# EAGLE design mcuBoard (EAGLE 7.4.0)
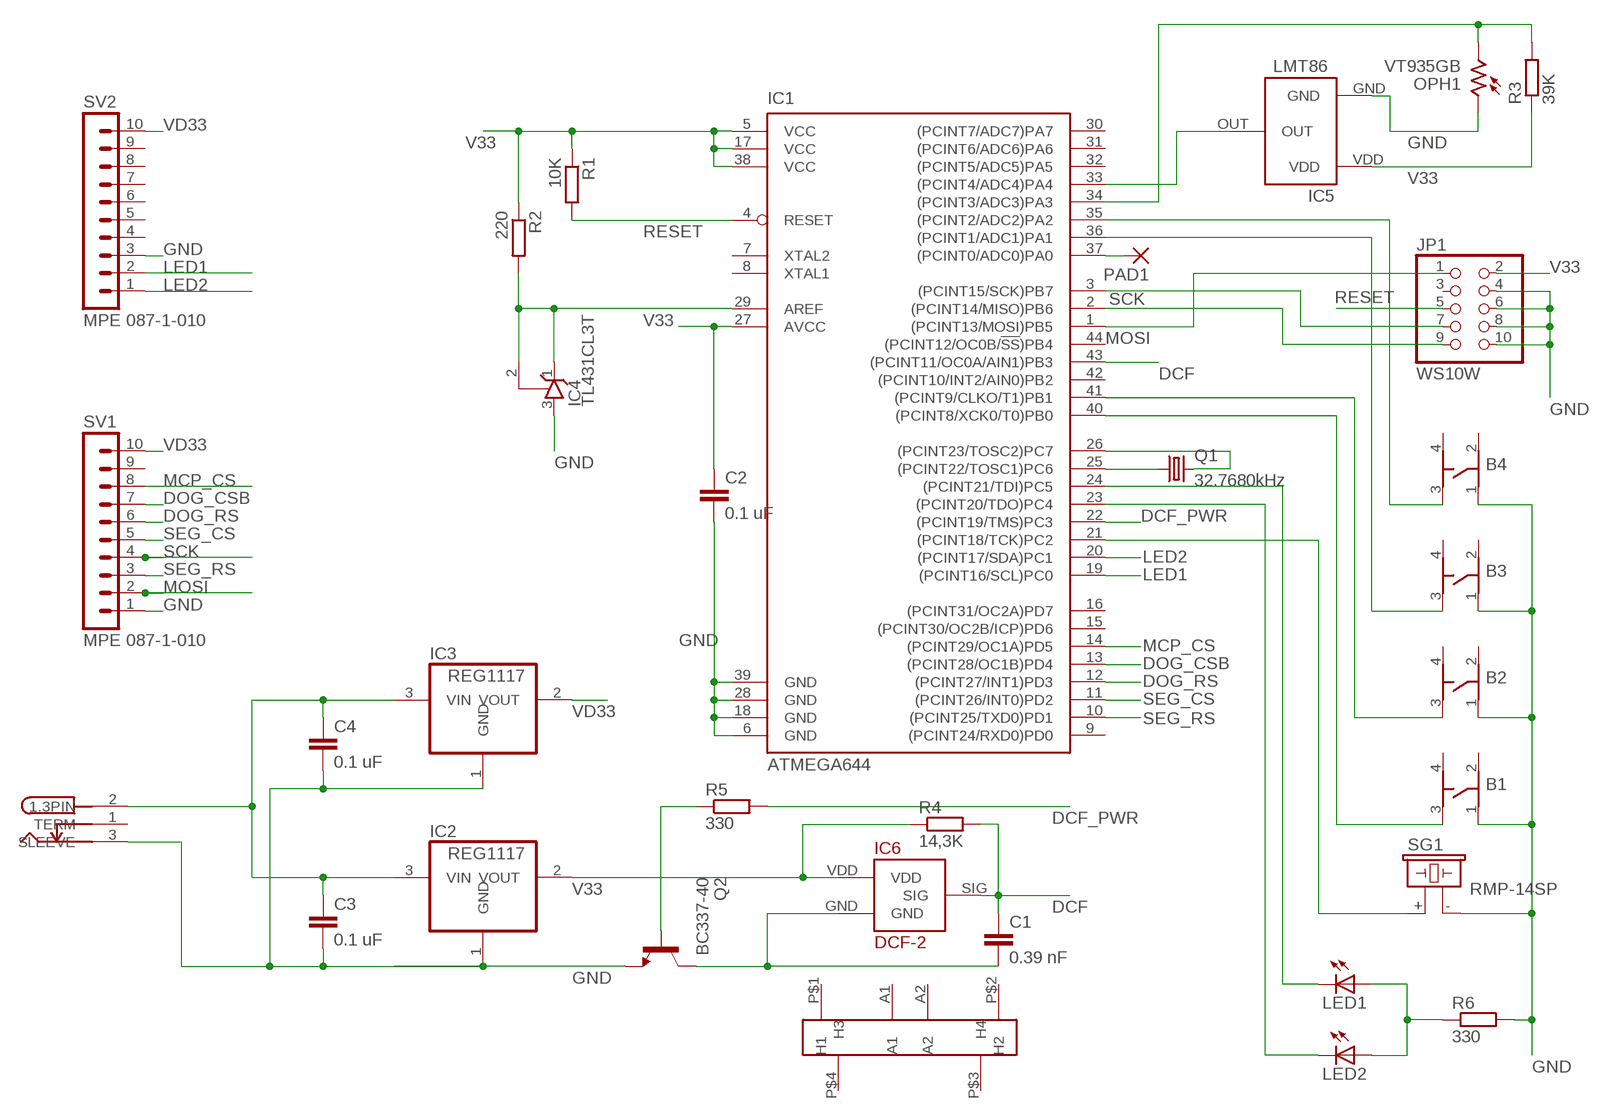
[diagram p0: schematic, sheet 1]

## Parts
B1  BUTTON-D6X  [BUTTON-D6X]
B2  BUTTON-D6X  [BUTTON-D6X]
B3  BUTTON-D6X  [BUTTON-D6X]
B4  BUTTON-D6X  [BUTTON-D6X]
C1  0.39 nF  C-EUC1206  [C1206]
C2  0.1 uF  C-EUC1206K  [C1206K]
C3  0.1 uF  C-EUC1206K  [C1206K]
C4  0.1 uF  C-EUC1206K  [C1206K]
IC1  ATMEGA644  ATMEGA644A  [TQFP44]
IC2  REG1117  [SOT223]
IC3  REG1117  [SOT223]
IC4  TL431CL3T  [SOT23]
IC5  LMT86  [LMT86]
IC6  DCF77  [DCF77]
JP1  WS10W  PINHD-2X5  [2X05]
LED1  LED3MM  [LED3MM]
LED2  LED3MM  [LED3MM]
OPH1  VT935GB  [VT900]
PAD1  1,6/0,8  [1,6/0,8]
Q1  32.7680kHz  MC-306  [MC-306]
Q2  BC337-40  [TO92]
R1  10K  R-EU_M1206  [M1206]
R2  220  R-EU_M1206  [M1206]
R3  39K  R-EU_M1206  [M1206]
R4  14,3K  R-EU_R1206  [R1206]
R5  330  R-EU_R1206  [R1206]
R6  330  R-EU_M1206  [M1206]
SG1  RMP-14SP  F/CM12P  [F/CM12P]
SV1  MPE 087-1-010  MA10-1  [MA10-1]
SV2  MPE 087-1-010  MA10-1  [MA10-1]
U$1  DC-8N  [BUCHSE-1.3X3.75]
U$2  DCF77-ANT  [DCF77-ANT]

## Nets
DCF: C1.1 IC1.43((PCINT11/OC0A/AIN1)PB3) IC6.SIG R4.2
DCF_PWR: IC1.22((PCINT19/TMS)PC3) R5.2
DOG_CSB: IC1.13((PCINT28/OC1B)PD4) SV1.7
DOG_RS: IC1.12((PCINT27/INT1)PD3) SV1.6
GND: B1.1 B2.1 B3.1 B4.1 C2.2 C3.2 C4.2 IC1.6(GND) IC1.18(GND) IC1.28(GND) IC1.39(GND) IC2.1(GND) IC3.1(GND) IC4.3(A) IC5.GND JP1.4 JP1.6 JP1.8 JP1.10 OPH1.1 Q2.1(E) R6.2 SG1.- SV1.1 SV2.3 U$1.3(SLEEVE)
LED1: IC1.19((PCINT16/SCL)PC0) SV2.2
LED2: IC1.20((PCINT17/SDA)PC1) SV2.1
MCP_CS: IC1.14((PCINT29/OC1A)PD5) SV1.8
MOSI: IC1.1((PCINT13/MOSI)PB5) JP1.1 SV1.2
N$1: C3.1 C4.1 IC2.3(VIN) IC3.3(VIN) U$1.2(1.3PIN)
N$18: IC1.2((PCINT14/MISO)PB6) JP1.9
N$28: B3.3 IC1.36((PCINT1/ADC1)PA1)
N$29: B2.3 IC1.41((PCINT9/CLKO/T1)PB1)
N$30: B1.3 IC1.40((PCINT8/XCK0/T0)PB0)
N$38: IC1.25((PCINT22/TOSC1)PC6) Q1.1
N$39: IC1.29(AREF) IC4.1(C) IC4.2(R) R2.2
N$40: IC1.26((PCINT23/TOSC2)PC7) Q1.4
N$41: IC1.21((PCINT18/TCK)PC2) SG1.+
N$42: IC1.33((PCINT4/ADC4)PA4) IC5.OUT
N$45: B4.3 IC1.35((PCINT2/ADC2)PA2)
N$47: IC1.34((PCINT3/ADC3)PA3) OPH1.2 R3.2
N$50: IC1.37((PCINT0/ADC0)PA0) PAD1.1(P)
N$54: C1.2 IC6.GND Q2.3(C)
N$55: Q2.2(B) R5.1
N$56: LED1.A LED2.A R6.1
N$58: IC1.24((PCINT21/TDI)PC5) LED1.K(C)
N$60: IC1.23((PCINT20/TDO)PC4) LED2.K(C)
RESET: IC1.4(RESET) JP1.5 R1.2
SCK: IC1.3((PCINT15/SCK)PB7) JP1.7 SV1.4
SEG_CS: IC1.11((PCINT26/INT0)PD2) SV1.5
SEG_RS: IC1.10((PCINT25/TXD0)PD1) SV1.3
V33: C2.1 IC1.5(VCC) IC1.17(VCC) IC1.27(AVCC) IC1.38(VCC) IC2.2(VOUT) IC5.VDD IC6.VDD JP1.2 R1.1 R2.1 R3.1 R4.1
VD33: IC3.2(VOUT) SV1.10 SV2.10
Unconnected: B1.2 B1.4 B2.2 B2.4 B3.2 B3.4 B4.2 B4.4 IC1.7(XTAL2) IC1.8(XTAL1) IC1.9((PCINT24/RXD0)PD0) IC1.15((PCINT30/OC2B/ICP)PD6) IC1.16((PCINT31/OC2A)PD7) IC1.30((PCINT7/ADC7)PA7) IC1.31((PCINT6/ADC6)PA6) IC1.32((PCINT5/ADC5)PA5) IC1.42((PCINT10/INT2/AIN0)PB2) IC1.44((PCINT12/OC0B/!SS!)PB4) JP1.3 SV1.9 SV2.4 SV2.5 SV2.6 SV2.7 SV2.8 SV2.9 U$1.1(TERM) U$2.A1 U$2.A2 U$2.P$1(H1) U$2.P$2(H2) U$2.P$3(H4) U$2.P$4(H3)

## Library data of the parts
B1-B4 = MyComponents:BUTTON-D6X
C1-C4 = rcl:C-EU: CAPACITOR, European symbol
IC1 = atmel:ATMEGA644: 8-bit Microcontroller with 64K Bytes In-System Programmable Flash Source: http://www.atmel.com/dyn/resources/prod_documents/doc2593.pdf; MPN: ATMEGA644PV-10AU; OC_FARNELL: 1455123; OC_NEWARK: 58M3748
IC2 IC3 = burr-brown:REG1117: 800mA and 1A Low Dropout (LDO) Positive Regulator 1.8V, 2.5V, 2.85V, 3.3V, 5V, and Adj; MPN: REG1117; OC_FARNELL: 1097566; OC_NEWARK: 14P6981
IC4 = MyComponents:TL431CL3T
IC5 = MyComponents:LMT86: Analog Temperature Sensors withClass-AB Output
IC6 = MyComponents:DCF77: DCF-Empfangsmodul DCF-2 von ELV
JP1 = pinhead:PINHD-2X5: PIN HEADER
LED1 LED2 = led:LED: LED OSRAM: - CHIPLED LG R971, LG N971, LY N971, LG Q971, LY Q971, LO R971, LY R971 LH N974, LH R974 LS Q976, LO Q976, LY Q976 LO Q996 - Hyper CHIPLED LW Q18S LB Q993, LB Q99A, LB R99A - SideLED LS A670, LO A670, LY A670, LG A670, LP A670 LB A673, LV A673, LT A673, LW A673 LH A674 LY A675 LS A676, LA A676, LO A676, LY A676, LW A676 LS A679, LY A679, LG A679 - Hyper Micro SIDELED® LS Y876, LA Y876, LO Y876, LY Y876 LT Y87S - SmartLED LW L88C, LW L88S LB L89C, LB L89S, LG L890 LS L89K, LO L89K, LY L89K LS L896, LA L896, LO L896, LY L896 - TOPLED LS T670, LO T670, LY T670, LG T670, LP T670 LSG T670, LSP T670, LSY T670, LOP T670, LYG T670 LG T671, LOG T671, LSG T671 LB T673, LV T673, LT T673, LW T673 LH T674 LS T676, LA T676, LO T676, LY T676, LB T676, LH T676, LSB T676, LW T676 LB T67C, LV T67C, LT T67C, LS T67K, LO T67K, LY T67K, LW E67C LS E67B, LA E67B, LO E67B, LY E67B, LB E67C, LV E67C, LT E67C LW T67C LS T679, LY T679, LG T679 LS T770, LO T770, LY T770, LG T770, LP T770 LB T773, LV T773, LT T773, LW T773 LH T774 LS E675, LA E675, LY E675, LS T675 LS T776, LA T776, LO T776, LY T776, LB T776 LHGB T686 LT T68C, LB T68C - Hyper Mini TOPLED® LB M676 - Mini TOPLED Santana® LG M470 LS M47K, LO M47K, LY M47K Source: http://www.osram.convergy.de LUXEON: - LUMILED® LXK2-PW12-R00, LXK2-PW12-S00, LXK2-PW14-U00, LXK2-PW14-V00 LXK2-PM12-R00, LXK2-PM12-S00, LXK2-PM14-U00 LXK2-PE12-Q00, LXK2-PE12-R00, LXK2-PE12-S00, LXK2-PE14-T00, LXK2-PE14-U00 LXK2-PB12-K00, LXK2-PB12-L00, LXK2-PB12-M00, LXK2-PB14-N00, LXK2-PB14-P00, LXK2-PB14-Q00 LXK2-PR12-L00, LXK2-PR12-M00, LXK2-PR14-Q00, LXK2-PR14-R00 LXK2-PD12-Q00, LXK2-PD12-R00, LXK2-PD12-S00 LXK2-PH12-R00, LXK2-PH12-S00 LXK2-PL12-P00, LXK2-PL12-Q00, LXK2-PL12-R00 Source: www.luxeon.com KINGBRIGHT: KA-3528ASYC Source: www.kingbright.com
OPH1 = photo-elements:VT9: Photoconductive Cell VT900 Series Source: http://optoelectronics.perkinelmer.com/content/Datasheets/DTS_vt900seriesdatasheet.pdf
PAD1 = wirepad:1,6/0,8: THROUGH-HOLE PAD
Q1 = crystal:MC-306: kHz RANGE CRYSTAL UNIT SMD Source: MC-306_405_406_E07X.PDF Homepage <http://www.epsontoyocom.co.jp>; MPN: MC-306 60.0KHZ 100PPM ,12.5PF; OC_FARNELL: 1278040; OC_NEWARK: 31M5576
Q2 = transistor-npn:BC337*: NPN Transistor
R1-R6 = rcl:R-EU_: RESISTOR, European symbol
SG1 = buzzer:F/CM12P: BUZZER Source: Buerklin; OC_FARNELL: unknown; OC_NEWARK: unknown
SV1 SV2 = con-lstb:MA10-1: PIN HEADER; OC_FARNELL: unknown; OC_NEWARK: unknown
U$1 = MyComponents:DC-8N: Niedervolt-Steckverbinder Buchse, Einbau horizontal 3.75 mm 1.3 mm Cliff DC-8N
U$2 = MyComponents:DCF77-ANT

## Board
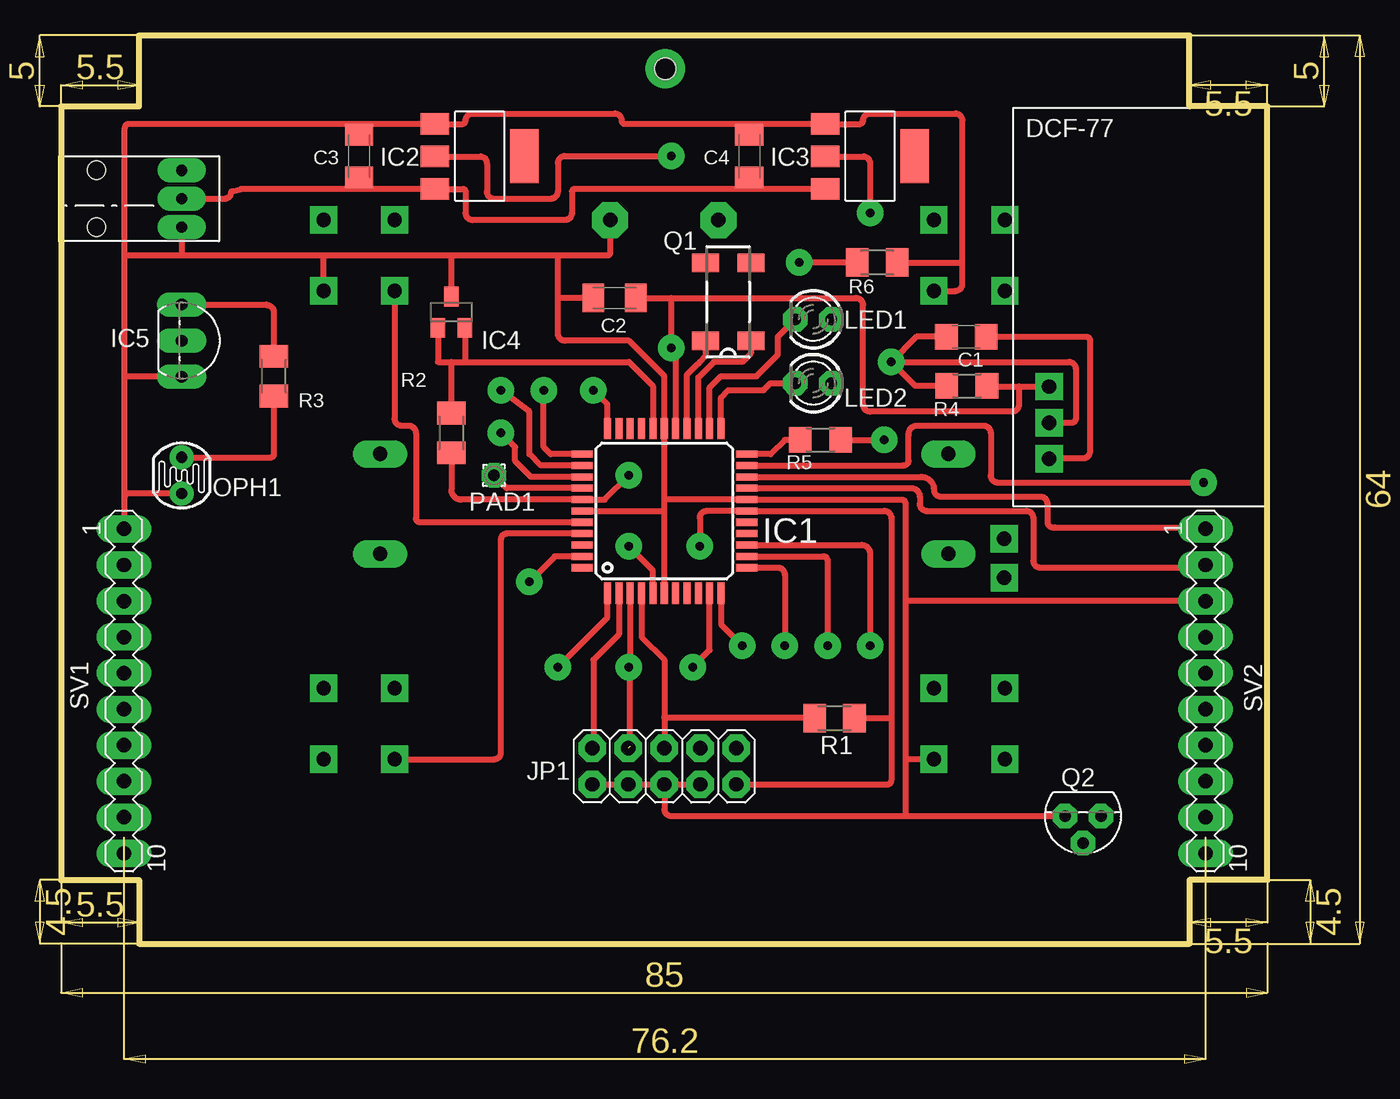
[diagram p1: board, top side]
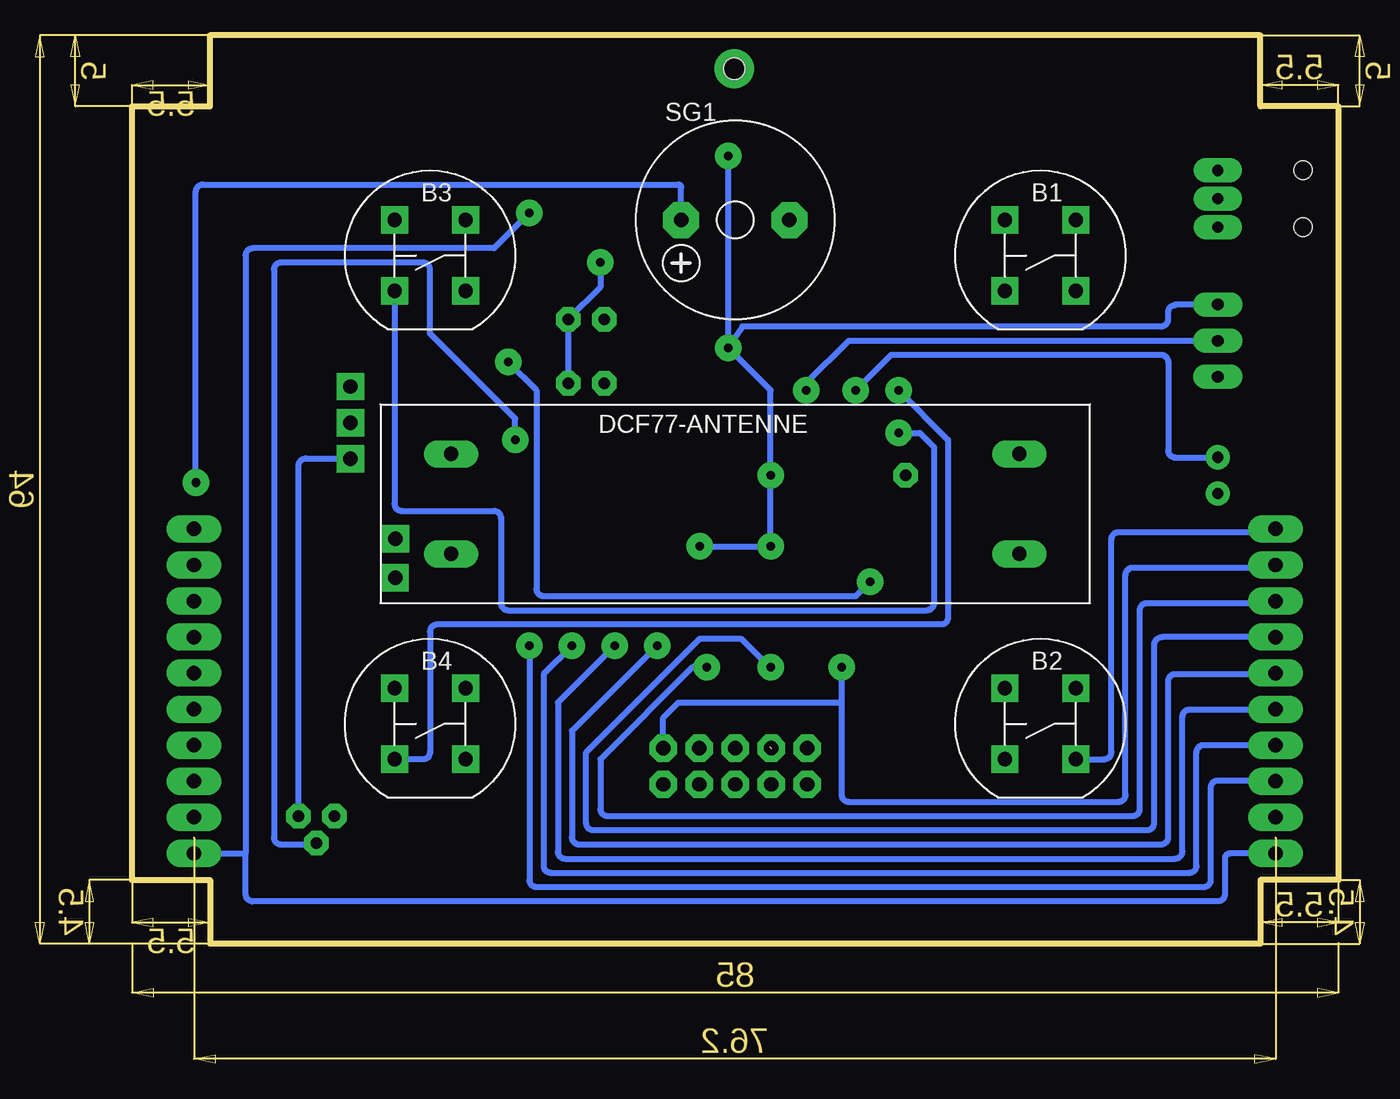
[diagram p2: board, bottom side, seen from below]

Size 85 x 64 mm. Coordinates in mm from the lower left corner, seen from the top.
Outline: 5.5,64 79.5,64 79.5,59 85,59 85,4.5 79.5,4.5 79.5,0 5.5,0 5.5,4.5 0,4.5 0,59 5.5,59 5.5,64
Copper layers (1*16): Top 0.035mm / dielectric 1.5mm / Bottom 0.035mm
Design rules "default *": minimum track width 20mil, minimum drill 32mil, track to track 12mil, track to pad 12mil, pad to pad 12mil, via to via 12mil, smd to smd 8mil, copper to edge 40mil, drill to drill 40mil, minimum pad ring 18mil, minimum via ring 25mil, stop-mask expansion 4mil, vias tented up to drill 0mil, thermal gap 10mil
Holes 1.5 mm at 42.56,61.66

### Footprints (pad centres in the part's own frame; a part is rotated, then mirrored left to right if it is on the bottom)
BUTTON-D6X = drill 1.016 square: 1 2.5,-2.5; 2 2.5,2.5; 3 -2.5,-2.5; 4 -2.5,2.5
C1206 = smd 1.6 x 1.8: 1 -1.4,0; 2 1.4,0
C1206K = smd 1.5 x 2: 1 -1.5,0; 2 1.5,0
TQFP44 = smd 1.5 x 0.5: 1 -5.8,4; 2 -5.8,3.2; 3 -5.8,2.4; 4 -5.8,1.6; 5 -5.8,0.8; 6 -5.8,0; 7 -5.8,-0.8; 8 -5.8,-1.6; 9 -5.8,-2.4; 10 -5.8,-3.2; 11 -5.8,-4; 23 5.8,-4; 24 5.8,-3.2; 25 5.8,-2.4; 26 5.8,-1.6; 27 5.8,-0.8; 28 5.8,0; 29 5.8,0.8; 30 5.8,1.6; 31 5.8,2.4; 32 5.8,3.2; 33 5.8,4 | smd 0.5 x 1.5: 12 -4,-5.8; 13 -3.2,-5.8; 14 -2.4,-5.8; 15 -1.6,-5.8; 16 -0.8,-5.8; 17 0,-5.8; 18 0.8,-5.8; 19 1.6,-5.8; 20 2.4,-5.8; 21 3.2,-5.8; 22 4,-5.8; 34 4,5.8; 35 3.2,5.8; 36 2.4,5.8; 37 1.6,5.8; 38 0.8,5.8; 39 0,5.8; 40 -0.8,5.8; 41 -1.6,5.8; 42 -2.4,5.8; 43 -3.2,5.8; 44 -4,5.8
SOT223 = smd 1.499 x 2.007: 1 -2.261,-3.15; 2 0.025,-3.15; 3 2.311,-3.15 | smd 3.81 x 2.007: 4 0,3.15
SOT23 = smd 1 x 1.4: 1 -0.95,-1.1; 2 0.95,-1.1; 3 0,1.1
LMT86 = drill 0.813 long: GND 2.54,0; OUT 0,0; VDD -2.54,0
DCF77 = drill 1.016 square: GND -6.35,-10.16; SIG -6.35,-7.62; VDD -6.35,-5.08
2X05 = drill 1.016 octagon: 1 -5.08,-1.27; 2 -5.08,1.27; 3 -2.54,-1.27; 4 -2.54,1.27; 5 0,-1.27; 6 0,1.27; 7 2.54,-1.27; 8 2.54,1.27; 9 5.08,-1.27; 10 5.08,1.27
LED3MM = drill 0.813 octagon: A -1.27,0; K 1.27,0
VT900 = drill 0.8 pad 1.4: 1 -1.27,0; 2 1.27,0
1,6/0,8 = drill 0.813 pad 1.6 octagon: 1 0,0
MC-306 = smd 1.3 x 1.9: 1 -2.75,-1.6; 2 2.75,-1.6; 3 2.75,1.6; 4 -2.75,1.6
TO92 = drill 0.813 octagon: 1 1.27,0; 2 0,1.905; 3 -1.27,0
M1206 = smd 1.6 x 2: 1 -1.4,0; 2 1.4,0
R1206 = smd 1.6 x 1.803: 1 -1.422,0; 2 1.422,0
F/CM12P = drill 1.016 pad 2.54 octagon: + 3.81,0; - -3.81,0
MA10-1 = drill 1.016 long: 1 -11.43,0; 2 -8.89,0; 3 -6.35,0; 4 -3.81,0; 5 -1.27,0; 6 1.27,0; 7 3.81,0; 8 6.35,0; 9 8.89,0; 10 11.43,0
BUCHSE-1.3X3.75 = drill 0.8 long: 1 -3,-2; 2 -3,0; 3 -3,2 | hole 1.3: 3,2; 3,-2
DCF77-ANT = drill 1.016 square: A1 -23.94,-2.465; A2 -23.96,-5.195 | drill 1.016 long: P$1 -20.02,3.52; P$2 -20.02,-3.52; P$3 20.02,-3.52; P$4 20.02,3.52

### Placement (x,y rotation side)
B1  21,48.5 0 bottom
B2  21,15.5 0 bottom
B3  64,48.5 0 bottom
B4  64,15.5 0 bottom
C1  63.78,42.77 0 top
C2  39,45.5 180 top
C3  21,55.5 90 top
C4  48.5,55.5 90 top
IC1  42.5,30.5 90 top
IC2  29.5,55.5 270 top
IC3  57,55.5 270 top
IC4  27.5,44.5 0 top
IC5  8.5,42.5 270 top
IC6  75.97,44.34 0 top
JP1  42.5,12.5 180 top
LED1  53,44 180 top
LED2  53,39.5 180 top
OPH1  8.5,33 90 top
PAD1  30.5,33 0 top
Q1  47,45.22 90 top
Q2  72,9 180 top
R1  54.5,15.9 180 top
R2  27.5,36 90 top
R3  15,40 270 top
R4  63.81,39.31 180 top
R5  53.5,35.5 180 top
R6  57.5,48 0 top
SG1  42.5,51 180 bottom
SV1  4.43,17.8 270 top
SV2  80.63,17.8 270 top
U$1  5.5,52.5 180 top
U$2  42.5,31 0 bottom

### Tracks (layer width: path | path; a pad name or v marks a point on that pad's centre or on a via)
DCF  (via drill 0.6)
  Top 0.406: v33,25.5 34.8,27.3 IC1.43 | C1.1 60.27,42.77 v58.5,41 | R4.2 60.19,39.31 v58.5,41 | v58.5,41 71,41 arc-90 71.5,40.5 71.5,37 arc-90 71.22,36.72 IC6.SIG
  Bottom 0.406: v33,25.5 34,24.5 56,24.5 arc90 56.5,25 56.5,39 v58.5,41
DCF_PWR
  Top 0.406: R5.2 51,35.5 50,34.5 IC1.22
DOG_CSB  (via drill 0.6)
  Top 0.406: IC1.13 53.7,27.3 arc-90 54,27 v54,21
  Bottom 0.406: v54,21 56,19 56,5.5 arc-90 55.5,5 10.5,5 arc-90 10,5.5 10,13.5 arc90 9.5,14 SV1.7 arc90 SV1.7
DOG_RS  (via drill 0.6)
  Top 0.406: IC1.12 50.5,26.5 arc-90 51,26 v51,21
  Bottom 0.406: v51,21 55,17 55,6.5 arc-90 54.5,6 11.5,6 arc-90 11,6.5 11,16 arc90 10.5,16.5 4.46,16.5 arc-90 SV1.6
GND
  Top 0.406: JP1.10 JP1.8 JP1.6 | JP1.6 JP1.4 | 48.5,57.76 IC3.1 56.26,57.76 arc90 56.5,58 arc-90 57,58.5 63,58.5 arc-90 63.5,58 63.5,48 | 48.5,57.76 39.74,57.76 arc-90 39.5,58 arc90 39,58.5 29,58.5 arc90 28.5,58 arc-90 28.26,57.76 IC2.1 21.5,57.76 | SV1.1 4.5,29.23 4.5,31.5 | 4.5,31.5 4.5,40 | 4.5,40 4.5,48.5 | 4.5,48.5 4.5,57.5 arc-90 4.76,57.76 21.5,57.76 | IC1.6 42.5,30.5 | IC1.39 42.5,30.5 | 42.5,30.5 42.5,31.3 | 42.5,31.3 IC1.28 42.5,40 40,42.5 35.5,42.5 arc-90 35,43 35,45.5 | 42.5,31.3 IC1.18 59.2,31.3 arc-90 59.5,31 59.5,24 | JP1.6 42.5,9.5 arc90 43,9 59.5,9 | 59.5,9 Q2.1 | 35,45.5 35,48.5 | 35,48.5 27.5,48.5 | 27.5,48.5 18.5,48.5 | 18.5,48.5 8.5,48.5 | 8.5,48.5 4.5,48.5 | C2.2 35,45.5 | B1.1 18.5,48.5 | IC4.3 27.5,48.5 | 59.5,24 59.5,13 | 59.5,13 59.5,9 | B4.1 59.5,13 | SV2.3 59.65,24.15 arc90 59.5,24 | IC5.GND 4.54,39.96 4.5,40 | OPH1.1 4.73,31.73 arc90 4.5,31.5 | C3.2 21.5,57.76 | C4.2 48.5,57.76 | U$1.3 8.5,48.5 | SG1.- 38.69,48.69 arc-90 38.5,48.5 35,48.5 | B3.1 63,46 arc90 63.5,46.5 63.5,48 | R6.2 63.5,48
  Bottom 0.406: B2.1 16.5,13 arc-90 16,13.5 16,28.5 arc90 15.5,29 4.66,29 arc-90 SV1.1
LED1
  Top 0.406: IC1.19 59.9,32.1 arc-90 60.5,31.5 60.5,31 arc90 61,30.5 68,30.5 arc-90 68.5,30 68.5,27 arc90 69,26.5 80.44,26.5 arc90 SV2.2
LED2
  Top 0.406: IC1.20 60.6,32.9 arc-90 61.5,32 arc90 62,31.5 69,31.5 arc-90 69.5,31 69.5,29.65 arc90 70.03,29.34 80.39,29.34 arc-90 SV2.1
MCP_CS  (via drill 0.6)
  Top 0.406: IC1.14 56.4,28.1 arc-90 57,27.5 v57,21
  Bottom 0.406: v57,21 57,4.5 arc-90 56.5,4 9.5,4 arc-90 9,4.5 9,11 arc90 8.5,11.5 4.48,11.5 arc90 SV1.8
MOSI  (via drill 0.6)
  Top 0.406: v35,19.5 38.5,23 IC1.1
  Bottom 0.406: JP1.1 47.58,15.92 46.5,17 35,17 | v35,19.5 35,17 | 35,17 35,10.5 arc-90 34.5,10 15.5,10 arc-90 15,10.5 15,26 arc90 14.5,26.5 4.62,26.5 arc-90 SV1.2
N$1
  Top 0.406: IC3.3 48.5,53.19 | 48.5,53.19 36.19,53.19 arc90 36,53 36,51.5 arc-90 35.5,51 29,51 arc-90 28.5,51.5 28.5,53 arc90 28.31,53.19 IC2.3 21.5,53.19 | 21.5,53.19 12.69,53.19 12,53 arc-90 11.5,52.5 U$1.2 | C3.1 21.5,53.19 | C4.1 48.5,53.69 arc90 48.5,53.19
N$3  (via drill 0.6)
  other vias: 43,55.5
N$17  (via drill 0.6)
  other vias: 57,51.5
N$18
  Top 0.406: IC1.2 39.3,21.8 37.5,20 37.5,13.85 JP1.9
N$21  (via drill 0.6)
  other vias: 40,33
N$22  (via drill 0.6)
  other vias: 40,28
N$23  (via drill 0.6)
  other vias: 43,42
N$24  (via drill 0.6)
  other vias: 45,28
N$26  (via drill 0.6)
  other vias: 35,19.5
N$27  (via drill 0.6)
  other vias: 31,39
N$28  (via drill 0.6)
  Top 0.406: IC1.36 33.1,32.9 32,34 32,35 v31,36
  Bottom 0.406: v31,36 29.5,36 28.5,35 28.5,24 arc90 29,23.5 58.5,23.5 arc90 59,24 59,30 arc-90 59.5,30.5 66,30.5 arc90 66.5,31 B3.3
N$29
  Top 0.406: B2.3 30.5,13 arc90 31,13.5 31,28.5 arc-90 31.4,28.9 IC1.41
N$30
  Top 0.406: B1.3 23.5,37 arc90 24,36.5 24.5,36.5 arc-90 25,36 25,30 arc90 25.3,29.7 IC1.40
N$31  (via drill 0.6)
  other vias: 57,21
N$32  (via drill 0.6)
  other vias: 54,21
N$33  (via drill 0.6)
  other vias: 51,21
N$34  (via drill 0.6)
  other vias: 48,21
N$35  (via drill 0.6)
  other vias: 44.5,19.5
N$36  (via drill 0.6)
  other vias: 40,19.5
N$38
  Top 0.406: IC1.25 44.9,39.9 46,41 48,41 48.6,41.6 Q1.1
N$39
  Top 0.406: IC4.1 26.55,41 27.5,41 | 27.5,41 28.45,41 | IC4.2 28.45,41 | R2.2 27.5,41 | 28.45,41 40,41 41.7,39.3 IC1.29
N$40
  Top 0.406: IC1.26 44.1,40.1 44.75,40.75 45,41 45.4,41.4 Q1.4
N$41  (via drill 0.6)
  Top 0.406: IC1.21 59.32,33.7 arc90 59.71,34.06 59.71,35.82 arc-90 60.21,36.5 65,36.5 arc-90 65.5,36 65.5,33 arc90 66,32.5 v80.5,32.5
  Bottom 0.406: v80.5,32.5 80.5,53 arc90 80,53.5 46.5,53.5 arc90 46.31,53.31 SG1.+
N$42  (via drill 0.6)
  Top 0.406: IC1.33 38.5,38 v37.5,39
  Bottom 0.406: v37.5,39 37.5,39.5 34.5,42.5 IC5.OUT
N$43  (via drill 0.6)
  other vias: 37.5,39
N$45  (via drill 0.6)
  Top 0.406: IC1.35 33.8,33.7 33,34.5 33,37.5 v31,39
  Bottom 0.406: B4.3 64.5,13 arc-90 64,13.5 64,22 arc90 63.5,22.5 28,22.5 arc-90 27.5,23 27.5,35.5 v31,39
N$46  (via drill 0.6)
  other vias: 31,36
N$47  (via drill 0.6)
  Top 0.406: OPH1.2 14.77,34.27 arc90 15,34.5 R3.2 | IC1.34 34.5,34.5 34,35 v34,39
  Bottom 0.406: OPH1.2 11.5,34.27 arc90 12,34.77 12,41 arc-90 12.5,41.5 31.5,41.5 v34,39
N$48  (via drill 0.6)
  other vias: 34,39
N$50
  Top 0.406: IC1.37 31.4,32.1 PAD1.1
N$51  (via drill 0.6)
  other vias: 58,35.5
N$52  (via drill 0.6)
  other vias: 58.5,41
N$53  (via drill 0.6)
  other vias: 33,25.5
N$54
  Top 0.406: IC6.GND arc-90 69.72,34.2 71.91,34.2 arc90 72.5,34.67 72.5,42.5 arc90 72.23,42.77 C1.2
  Bottom 0.406: Q2.3 73.27,33.73 arc90 72.65,34.19 69.64,34.19 arc-90 IC6.GND
N$55  (via drill 0.6)
  Top 0.406: R5.1 v58,35.5
  Bottom 0.406: v58,35.5 58,37 64,43 64,47.5 arc-90 64.5,48 74.5,48 arc-90 75,47.5 75,7.5 arc-90 74.5,7 72,7 Q2.2
N$56  (via drill 0.6)
  Top 0.406: R6.1 v52,48
  Bottom 0.406: v52,48 52,46.27 LED1.A LED2.A
N$57  (via drill 1.5)
  other vias: 42.56,61.66
N$58
  Top 0.406: IC1.24 45.7,39.2 46.5,40 49,40 50.5,41.5 50.5,42.77 LED1.K
N$60
  Top 0.406: IC1.23 46.5,38.5 47,39 49.5,39 50,39.5 LED2.K
N$63  (via drill 0.6)
  other vias: 80.5,32.5
N$64  (via drill 0.6)
  other vias: 52,48
RESET
  Top 0.406: IC1.4 40.9,21.6 42.5,20 42.5,16 | 42.5,16 JP1.5 | R1.2 42.59,15.91 arc-90 42.5,16
SCK  (via drill 0.6)  (2 unrouted)
  Top 0.406: IC1.3 40.1,19.6 arc-90 v40,19.5 40.1,19.4 40.1,13.91
  Bottom 0.406: SV1.4 12.39,21.61 arc-90 13,21 13,8.5 arc90 13.5,8 52.5,8 arc90 53,8.5 53,13.5 45,21.5 42.1,21.5 40.1,19.5 v40,19.5
SEG_CS  (via drill 0.6)
  Top 0.406: IC1.11 46.5,22.5 v48,21
  Bottom 0.406: v48,21 54,15 54,7.5 arc-90 53.5,7 12.5,7 arc-90 12,7.5 12,18.5 arc90 11.5,19 4.5,19 arc-90 SV1.5
SEG_RS  (via drill 0.6)
  Top 0.406: v44.5,19.5 45.7,20.7 IC1.10
  Bottom 0.406: v44.5,19.5 45.5,19.5 52,13 52,9.5 arc-90 51.5,9 14.5,9 arc-90 14,9.5 14,23.5 arc90 13.5,24 4.58,24 arc-90 SV1.3
V33  (via drill 0.6)
  Top 0.406: v40,33 38.3,31.3 IC1.38 28.2,31.3 arc-90 27.5,32 R2.1 | IC1.27 43.3,41.7 v43,42 43,45.5 C2.1 56,45.5 arc-90 56.5,45 56.5,38 arc90 57,37.5 67,37.5 arc90 67.5,38 67.5,39.26 | IC1.5 41.7,26.3 v40,28 | v45,28 45,30 arc-90 45.5,30.5 IC1.17 58,30.5 arc-90 58.5,30 58.5,16 | IC2.2 29.52,55.48 arc-90 30,55 30,53 arc90 30.5,52.5 34.5,52.5 arc90 35,53 35,55 arc-90 35.5,55.5 v43,55.5 | JP1.2 58.23,11.23 arc90 58.5,11.5 58.5,16 | R3.1 15,44.5 arc90 14.5,45 arc90 14.46,45.04 IC5.VDD | R1.1 58.41,15.91 arc90 58.5,16 | R4.1 arc90 65.66,39.26 67.5,39.26 | 67.5,39.26 IC6.VDD
  Bottom 0.406: v43,42 40,39 v40,33 v40,28 v45,28 | v43,55.5 v43,42 | v43,42 42,43.5 12.5,43.5 arc-90 12,44 12,44.5 arc90 11.5,45 arc90 11.46,45.04 IC5.VDD
VD33  (via drill 0.6)
  Top 0.406: IC3.2 56.52,55.48 arc-90 57,55 v57,51.5
  Bottom 0.406: SV1.10 7.63,6.37 arc-90 8,6 8,3.5 arc90 8.5,3 76.5,3 arc90 77,3.5 77,6.37 | SV2.10 77,6.37 | v57,51.5 59.5,49 76.5,49 arc-90 77,48.5 77,6.37